# Altium schematic sheet Sheet1.SchDoc
size 410 x 297 mm; SheetNumber: 1; SheetTotal: 1
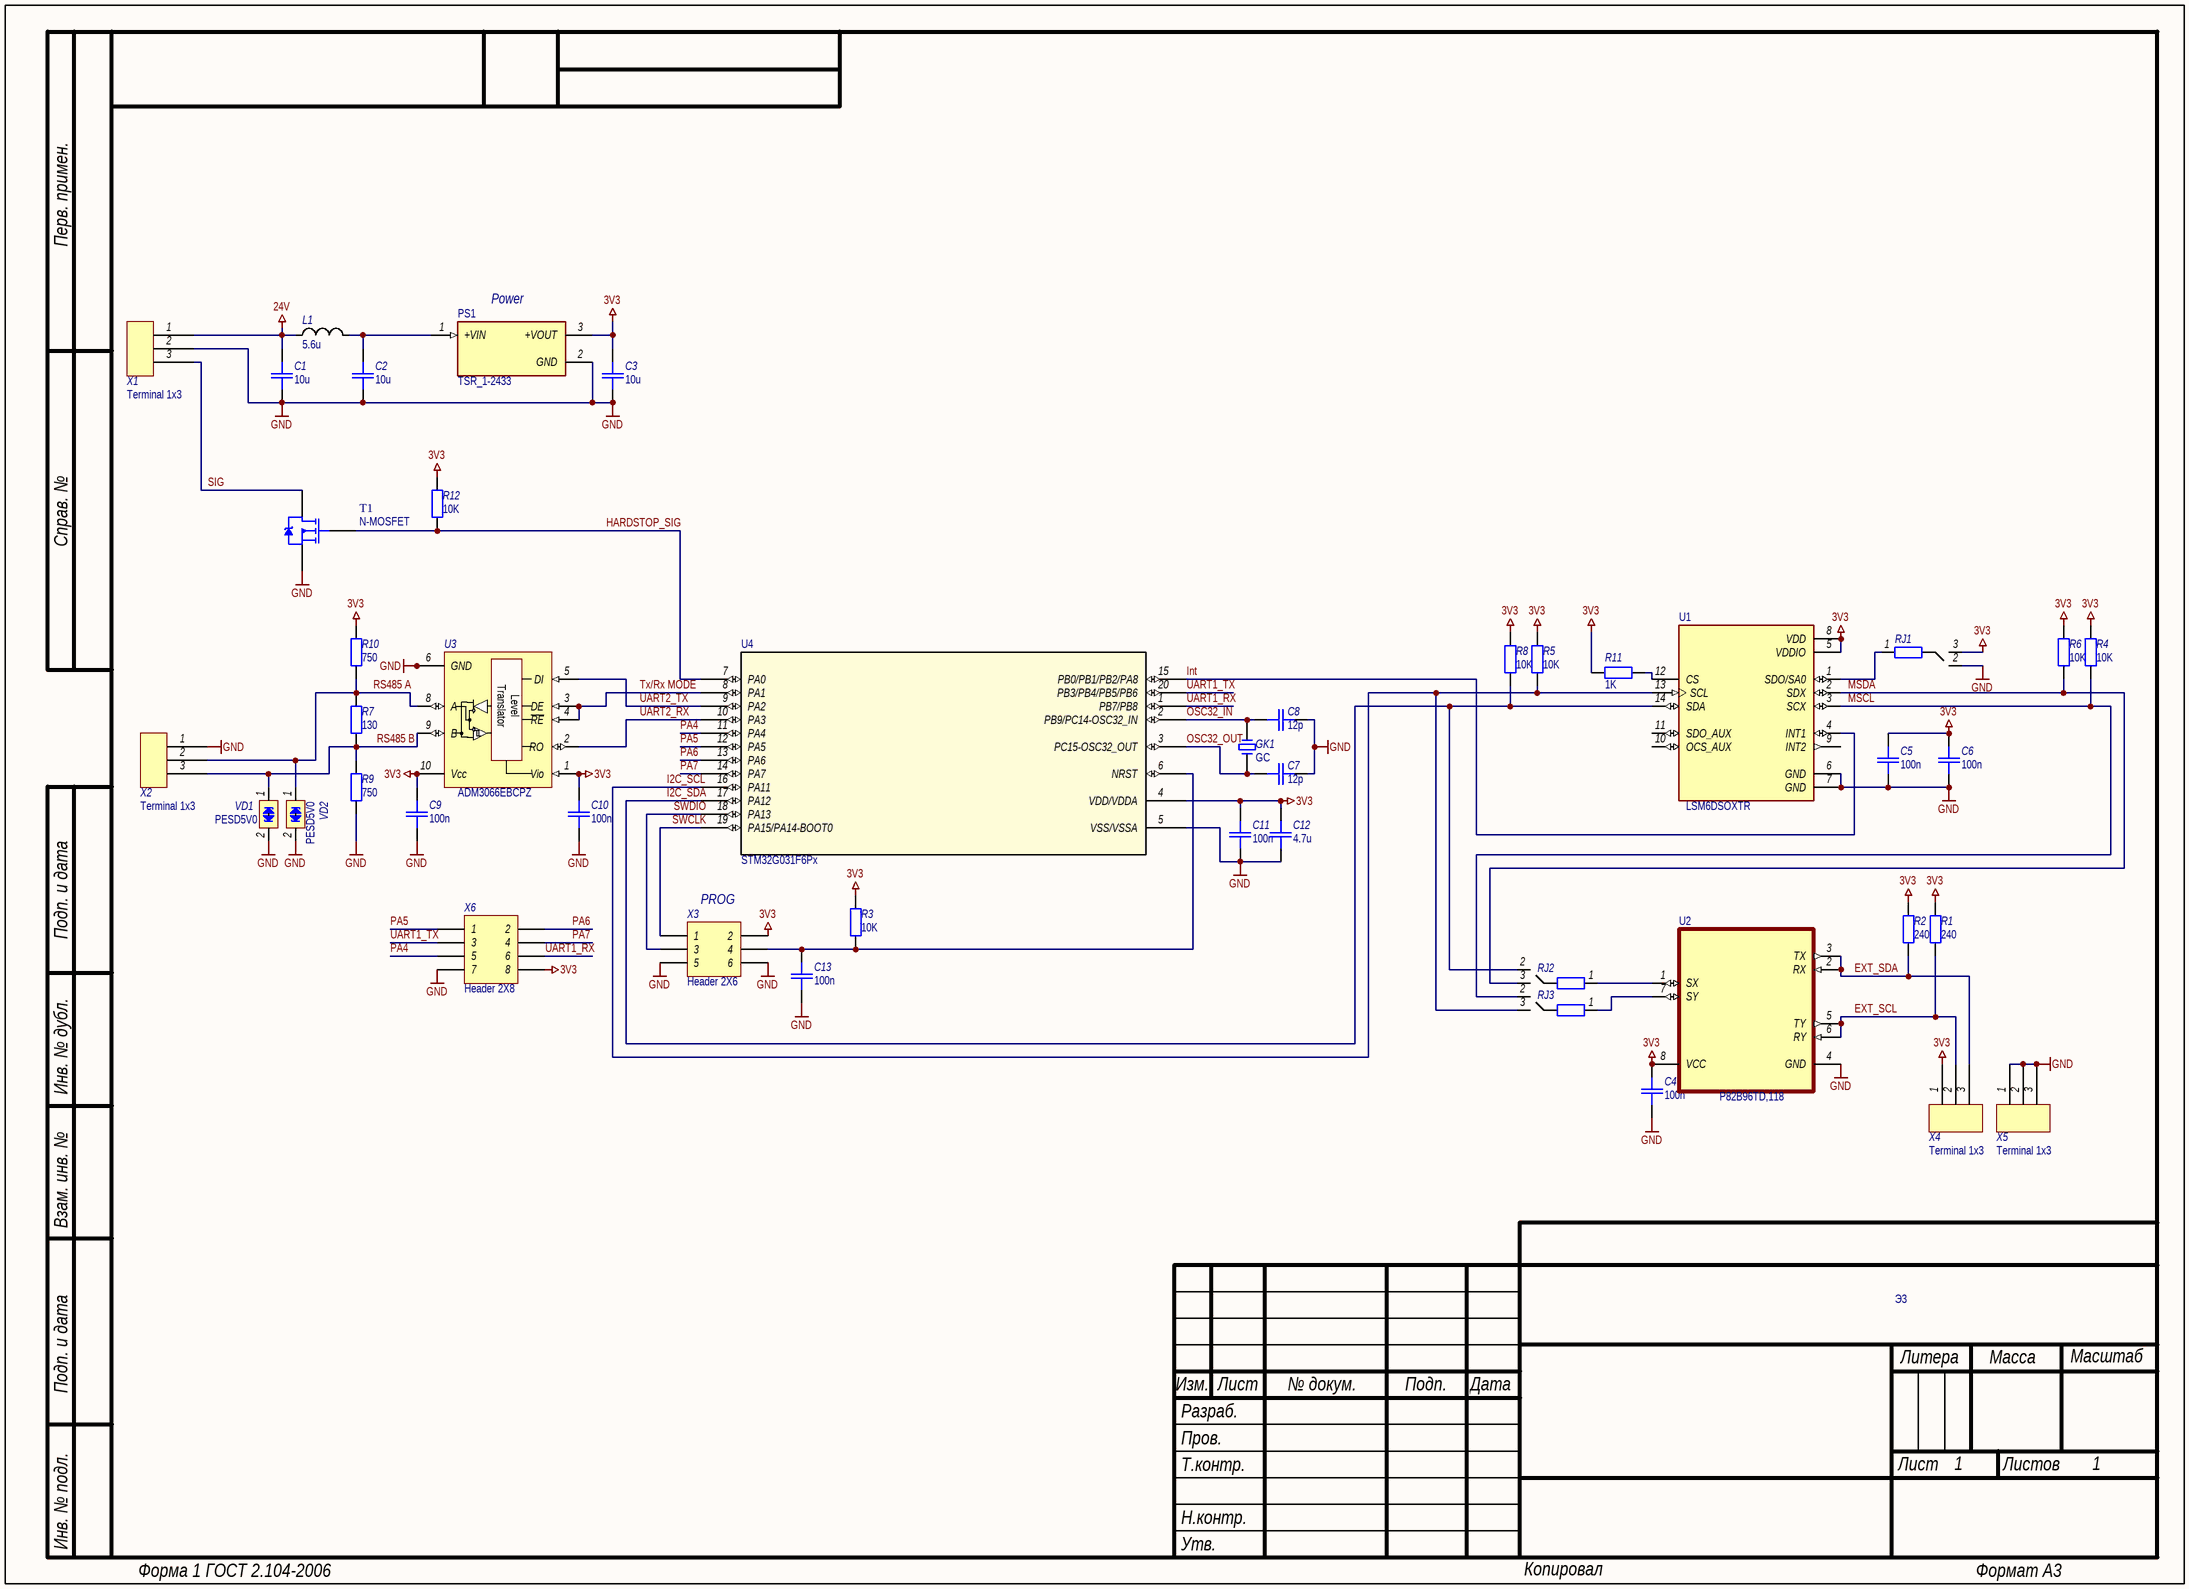
[diagram p0: Sheet1.SchDoc]

## Parts
C1  value 10u  [SMD_C0805]  (hidden comment: K10-79)
C2  value 10u  [SMD_C0805]  (hidden comment: K10-79)
C3  value 10u  [SMD_C0805]  (hidden comment: K10-79)
C4  value 100n  [SMD_C0805]  (hidden comment: K10-79)
C5  value 100n  [SMD_C0805]  (hidden comment: K10-79)
C6  value 100n  [SMD_C0805]  (hidden comment: K10-79)
C7  value 12p  [SMD_C0805]  (hidden comment: K10-79)
C8  value 12p  [SMD_C0805]  (hidden comment: K10-79)
C9  value 100n  [SMD_C0805]  (hidden comment: K10-79)
C10  value 100n  [SMD_C0805]  (hidden comment: K10-79)
C11  value 100n  [SMD_C0805]  (hidden comment: K10-79)
C12  value 4.7u  [SMD_C0805]  (hidden comment: K10-79)
C13  value 100n  [SMD_C0805]  (hidden comment: K10-79)
GK1  Наименование: GC  [DT-38T]  (hidden comment: 32.768k)
L1  value 5.6u  [SMD_0805]  (hidden comment: Inductor)
PS1  TSR_1-2433  [CONV_TSR_1-2433]
R1  value 240  [SMD_0805]  (hidden comment: OSM R1-8)
R2  value 240  [SMD_0805]  (hidden comment: OSM R1-8)
R3  value 10K  [SMD_0805]  (hidden comment: OSM R1-8)
R4  value 10K  [SMD_0805]  (hidden comment: OSM R1-8)
R5  value 10K  [SMD_0805]  (hidden comment: OSM R1-8)
R6  value 10K  [SMD_0805]  (hidden comment: OSM R1-8)
R7  value 130  [SMD_0805]  (hidden comment: OSM R1-8)
R8  value 10K  [SMD_0805]  (hidden comment: OSM R1-8)
R9  value 750  [SMD_0805]  (hidden comment: OSM R1-8)
R10  value 750  [SMD_0805]  (hidden comment: OSM R1-8)
R11  value 1K  [SMD_0805]  (hidden comment: OSM R1-8)
R12  value 10K  [SMD_0805]  (hidden comment: OSM R1-8)
RJ1  OSM R1-8  [SMD_JMP_0805]  (value not drawn)
RJ2  OSM R1-8  [SMD_JMP_0805]  (value not drawn)
RJ3  OSM R1-8  [SMD_JMP_0805]  (value not drawn)
T1  N-MOSFET  [SOT-23]
U1  LSM6DSOXTR  [PQFN50P250X300X86-14N]
U2  P82B96TD,118  [SOIC127P600X175-8N]
U3  ADM3066EBCPZ  [LFCSP-10_3x3]
U4  STM32G031F6Px  [TSSOP20]
VD1  PESD5V0  [SOD-323]
VD2  PESD5V0  [SOD-323]
X1  Terminal 1x3  [DXMG-3WAY]
X2  Terminal 1x3  [DXMG-3WAY]
X3  Header 2X6  [PLD2-6]
X4  Terminal 1x3  [DXMG-3WAY]
X5  Terminal 1x3  [DXMG-3WAY]
X6  Header 2X8  [PBD-8]

## Nets
3V3: C3.2 C4.2 C5.1 C6.1 C9.2 C10.2 C11.1 C12.1 PS1.3(+VOUT) R1.2 R2.2 R3.2 R4.2 R5.2 R6.2 R8.2 R10.1 R11.2 R12.1 RJ1.3 U1.5(VDDIO) U1.8(VDD) U2.8(VCC) U3.1(Vio) U3.10(Vcc) U4.4(VDD/VDDA) X3.2 X4.1 X6.8
24V: C1.2 L1.1 X1.1
GND: C1.1 C2.1 C3.1 C4.1 C5.2 C6.2 C7.1 C8.1 C9.1 C10.1 C11.2 C12.2 C13.2 PS1.2(GND) R9.1 RJ1.2 T1.S(SOURCE) U1.6(GND) U1.7(GND) U2.4(GND) U3.6(GND) U3.11(GND) U4.5(VSS/VSSA) VD1.2(cathode_2) VD2.2(cathode_2) X1.2 X2.1 X3.5 X3.6 X5.1 X5.2 X5.3 X6.7
EXT_SCL: R1.1 U2.5(TY) U2.6(RY) X4.2
EXT_SDA: R2.1 U2.2(RX) U2.3(TX) X4.3
HARDSTOP_SIG: R12.2 T1.G(GATE) U4.7(PA0)
I2C_SCL: R5.1 RJ3.3 U1.13(SCL) U4.16(PA11)
I2C_SDA: R8.1 RJ2.2 U1.14(SDA) U4.17(PA12)
Int: U1.4(INT1) U4.15(PB0/PB1/PB2/PA8)
MSCL: R4.1 RJ3.2 U1.3(SCX)
MSDA: R6.1 RJ2.3 U1.2(SDX)
OSC32_IN: C8.2 GK1.1 U4.2(PB9/PC14-OSC32_IN)
OSC32_OUT: C7.2 GK1.2 U4.3(PC15-OSC32_OUT)
PA4: U4.11(PA4) X6.5
PA5: U4.12(PA5) X6.1
PA6: U4.13(PA6) X6.2
PA7: U4.14(PA7) X6.4
RS485 A: R7.1 R10.2 U3.8(A) VD2.1(cathode_1) X2.2
RS485 B: R7.2 R9.2 U3.9(B) VD1.1(cathode_1) X2.3
SIG: T1.D(DRAIN) X1.3
SWCLK: U4.19(PA15/PA14-BOOT0) X3.1
SWDIO: U4.18(PA13) X3.3
Tx/Rx MODE: U3.3(DE) U3.4(~{RE}) U4.8(PA1)
UART1_RX: U4.1(PB7/PB8) X6.6
UART1_TX: U4.20(PB3/PB4/PB5/PB6) X6.3
UART2_RX: U3.2(RO) U4.10(PA3)
UART2_TX: U3.5(DI) U4.9(PA2)
NetC2_2: C2.2 L1.2 PS1.1(+VIN)
NetC13_1: C13.1 R3.1 U4.6(NRST) X3.4
NetR11_1: R11.1 U1.12(CS)
NetRJ1_1: RJ1.1 U1.1(SDO/SA0)
NetRJ2_1: RJ2.1 U2.1(SX)
NetRJ3_1: RJ3.1 U2.7(SY)

Not connected (* = marked no-connect by the designer): U1 9(INT2) 10(OCS_AUX) 11(SDO_AUX)

## Notes on the sheet
- (near PS1) Power
- (near X3) PROG
- Перв. примен.
- Справ. №
- Подп. и дата
- Инв. № дубл.
- Взам. инв. №
- Э3
- Изм.
- Разраб.
- Лист
- № докум.
- Подп.
- Дата
- Литера
- Масса
- Масштаб
- Пров.
- Т.контр.
- Листов
- Н.контр.
- Утв.
- Инв. № подл.
- Форма 1 ГОСТ 2.104-2006
- Копировал
- Формат А3
- (in symbol ADM3066E) Translator; Level

## Library data of the parts
C1-C13 = Capacitor: Назначение: SMD-конденсатор; Наименование: К10-79; Потребление, Вт: 0; Точность: %; Напряжение: В; Диэлектрик: *
GK1 = Crystal_Generic: Generic 2-Pin Crystal Oscillator; Потребление, Вт: 0.0; Назначение: 2-Pin Crystal Oscillator
L1 = Inductor: Наименование: Индуктивность; Назначение: SMD-индуктивность; Потребление, Вт: 0,010
PS1 = TSR_1-2433: 1 Amp POL switching regulator, 4.6 to -36 VDC input, pos.-pos. circuit, LM78 compatible, SIP-3; MP: TSR 1-2433; MF: Traco Power; Назначение: DC-DC; Purchase-URL: https://pricing.snapeda.com/search/part/TSR 1-2433/?ref=eda; Package: SIP-3 Traco Power; Availability: In Stock; Value: *; Price: None; SnapEDA_Link: https://www.snapeda.com/parts/TSR%201-2433/Traco%20Power/view-part/6027450/?ref=snap; Check_prices: https://www.snapeda.com/parts/TSR%201-2433/Traco%20Power/view-part/6027450/?ref=eda; Наименование: TSR 1-2433
R1-R12 = Resistor: Наименование: ОСМ Р1-12; Назначение: SMD-резистор; Потребление, Вт: 0,001; Точность: %
RJ1-RJ3 = Resistor_Jamper: Resistor-Jumper; Назначение: Резистор для выбора режима; Наименование: Резистор; Потребление, Вт: 0,0
T1 = N-MOSFET: N channel Generic MosFET; pin to pad: D>3 G>1 S>2; Потребление, Вт: 0,0; Назначение: N channel Generic MosFET; Наименование: N-MOSFET
U1 = LSM6DSOXTR: Accelerometer, Gyroscope, 6 Axis Sensor IÂ²C, SPI Output; MF: STMicroelectronics; Назначение: 6-axis IMU; Price: None; Value: *; Package: VFLGA-14 STMicroelectronics; SnapEDA_Link: https://www.snapeda.com/parts/LSM6DSOXTR/STMicroelectronics/view-part/3227828/?ref=snap; MP: LSM6DSOXTR; Availability: Unavailable; Наименование: LSM6DSOXTR
U2 = P82B96TD,118: Dual bidirectional bus buffer; MP: P82B96TD-118; Package: None; Price: None; Value: *; Availability: Unavailable
U3 = ADM3066E: 3.0 V to 5.5 V, ±12 kV IEC ESD Protected, 500 kbps/50 Mbps RS-485 Transceiver; Потребление, Вт: 0,1; Наименование: ADM3066EBCPZ; Назначение: RS-485 Transceiver
U4 = STM32G031F6Px: The STM32G031x4/x6/x8 mainstream microcontrollers are based on high-performance Arm® Cortex®-M0+ 32-bit RISC core operating at up to 64 MHz frequency. / 32 Kbytes of Flash program memory and 8 Kbytes of SRAM. With 20pin TSSOP 6.4x4.4 package; Manufacturer_Part_Number: stm32g0_tssop20_t1; Vendor: STMicroelectronics; Copyright: Copyright (C) 2018 Accelerated Designs. All rights reserved; RefDes: RefDes; Type: DEV; Наименование: STM32G031F6Px
VD1 VD2 = PESDxL1BA: Low capacitance bidirectional ESD protection diodes; Назначение: ESD защитные диоды; Потребление, Вт: 0.0; Наименование: PESDxL1BA; ComponentLink1Description: DataSheet; ComponentLink1URL: https://static.chipdip.ru/lib/635/DOC005635911.pdf
X1 X2 X4 X5 = Terminal 1x3: Потребление, Вт: 0,0; Наименование: DXMG 3WAY; Назначение: Terminal 1x3
X3 = Header 2X6: Header, 6-Pin, Dual row; Потребление, Вт: 0,0; Назначение: Header, 6-Pin, Dual row; Наименование: Header 2X6
X6 = Header 2X8: Header, 8-Pin, Dual row; Потребление, Вт: 0,0; Назначение: Header, 8-Pin, Dual row; Наименование: Header 2X8